# EAGLE design LedMatrix (EAGLE 7.4.0)
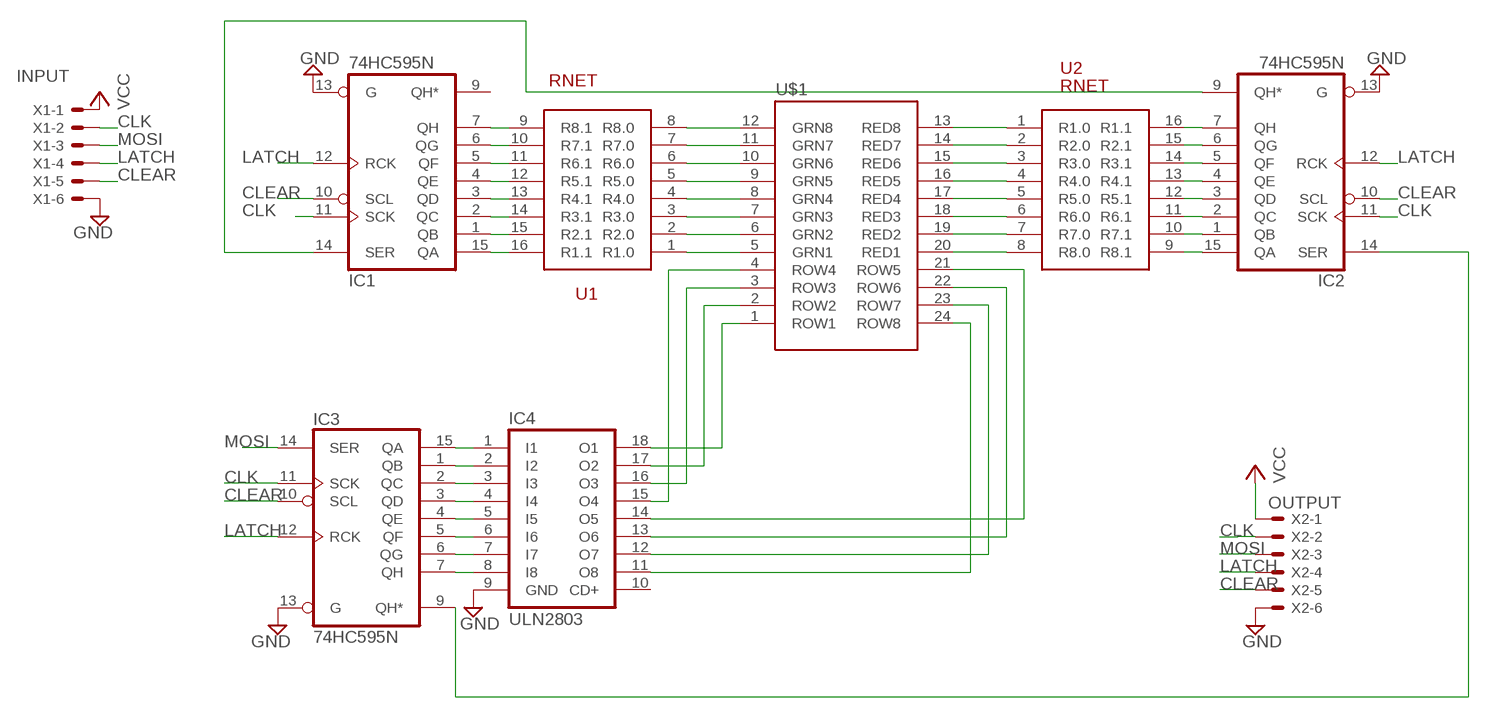
[diagram p0: schematic, sheet 1]

## Parts
IC1  74HC595N  [DIL16]
IC2  74HC595N  [DIL16]
IC3  74HC595N  [DIL16]
IC4  ULN2803  ULN2803A  [DIL18]
U1  RNET  RESISTER-NET-R4116  [DIP16]
U2  RNET  RESISTER-NET-R4116  [DIP16]
U$1  WLG-M2088A/8EG  [WLG-M2088A/8EG]
X1  INPUT  22-23-2061  [22-23-2061]
X2  OUTPUT  22-23-2061  [22-23-2061]

## Nets
CLEAR: IC1.10(SCL) IC2.10(SCL) IC3.10(SCL) X1.5 X2.5
CLK: IC1.11(SCK) IC2.11(SCK) IC3.11(SCK) X1.2 X2.2
GND: IC1.13(G) IC2.13(G) IC3.13(G) IC4.9(GND) X1.6 X2.6
LATCH: IC1.12(RCK) IC2.12(RCK) IC3.12(RCK) X1.4 X2.4
MOSI: IC3.14(SER) X1.3 X2.3
N$1: IC1.1(QB) U1.15(R2.1)
N$2: IC1.2(QC) U1.14(R3.1)
N$3: IC1.3(QD) U1.13(R4.1)
N$4: IC1.4(QE) U1.12(R5.1)
N$5: IC1.5(QF) U1.11(R6.1)
N$6: IC1.6(QG) U1.10(R7.1)
N$7: IC1.7(QH) U1.9(R8.1)
N$8: IC1.15(QA) U1.16(R1.1)
N$9: U1.1(R1.0) U$1.5(GRN1)
N$10: U1.2(R2.0) U$1.6(GRN2)
N$11: U1.3(R3.0) U$1.7(GRN3)
N$12: U1.4(R4.0) U$1.8(GRN4)
N$13: U1.5(R5.0) U$1.9(GRN5)
N$14: U1.6(R6.0) U$1.10(GRN6)
N$15: U1.7(R7.0) U$1.11(GRN7)
N$16: U1.8(R8.0) U$1.12(GRN8)
N$17: U2.1(R1.0) U$1.13(RED8)
N$18: U2.2(R2.0) U$1.14(RED7)
N$19: U2.3(R3.0) U$1.15(RED6)
N$20: U2.4(R4.0) U$1.16(RED5)
N$21: U2.5(R5.0) U$1.17(RED4)
N$22: U2.6(R6.0) U$1.18(RED3)
N$23: U2.7(R7.0) U$1.19(RED2)
N$24: U2.8(R8.0) U$1.20(RED1)
N$25: IC2.1(QB) U2.10(R7.1)
N$26: IC2.2(QC) U2.11(R6.1)
N$27: IC2.3(QD) U2.12(R5.1)
N$28: IC2.4(QE) U2.13(R4.1)
N$29: IC2.5(QF) U2.14(R3.1)
N$30: IC2.6(QG) U2.15(R2.1)
N$31: IC2.7(QH) U2.16(R1.1)
N$32: IC2.15(QA) U2.9(R8.1)
N$33: IC3.1(QB) IC4.2(I2)
N$34: IC3.2(QC) IC4.3(I3)
N$35: IC3.3(QD) IC4.4(I4)
N$36: IC3.4(QE) IC4.5(I5)
N$37: IC3.5(QF) IC4.6(I6)
N$38: IC3.6(QG) IC4.7(I7)
N$39: IC3.7(QH) IC4.8(I8)
N$40: IC3.15(QA) IC4.1(I1)
N$41: IC4.18(O1) U$1.1(ROW1)
N$42: IC4.17(O2) U$1.2(ROW2)
N$43: IC4.16(O3) U$1.3(ROW3)
N$44: IC4.15(O4) U$1.4(ROW4)
N$45: IC4.14(O5) U$1.21(ROW5)
N$46: IC4.13(O6) U$1.22(ROW6)
N$47: IC4.12(O7) U$1.23(ROW7)
N$48: IC4.11(O8) U$1.24(ROW8)
N$49: IC2.14(SER) IC3.9(QH*)
N$50: IC1.14(SER) IC2.9(QH*)
VCC: X1.1 X2.1
Unconnected: IC1.9(QH*) IC4.10(CD+)

## Power pins joined to a net without a drawn wire
GND: IC1.8(GND) IC2.8(GND) IC3.8(GND)
VCC: IC1.16(VCC) IC2.16(VCC) IC3.16(VCC)

## Library data of the parts
IC1-IC3 = 74xx-eu:74*595: 8-bit SHIFT REGISTER, output latch
IC4 = uln-udn:ULN2803A: DRIVER ARRAY
U1 U2 = sibosop:RESISTER-NET-R4116
U$1 = led-matrix-v2:WLG-M2088A: LED Matrix - Dual Color (Red + Green) - Medium sku: COM-00682 0.33 x 2 x 2"
X1 X2 = sibosop-con-molex:22-23-2061: .100" (2.54mm) Center Header - 6 Pin

## Board
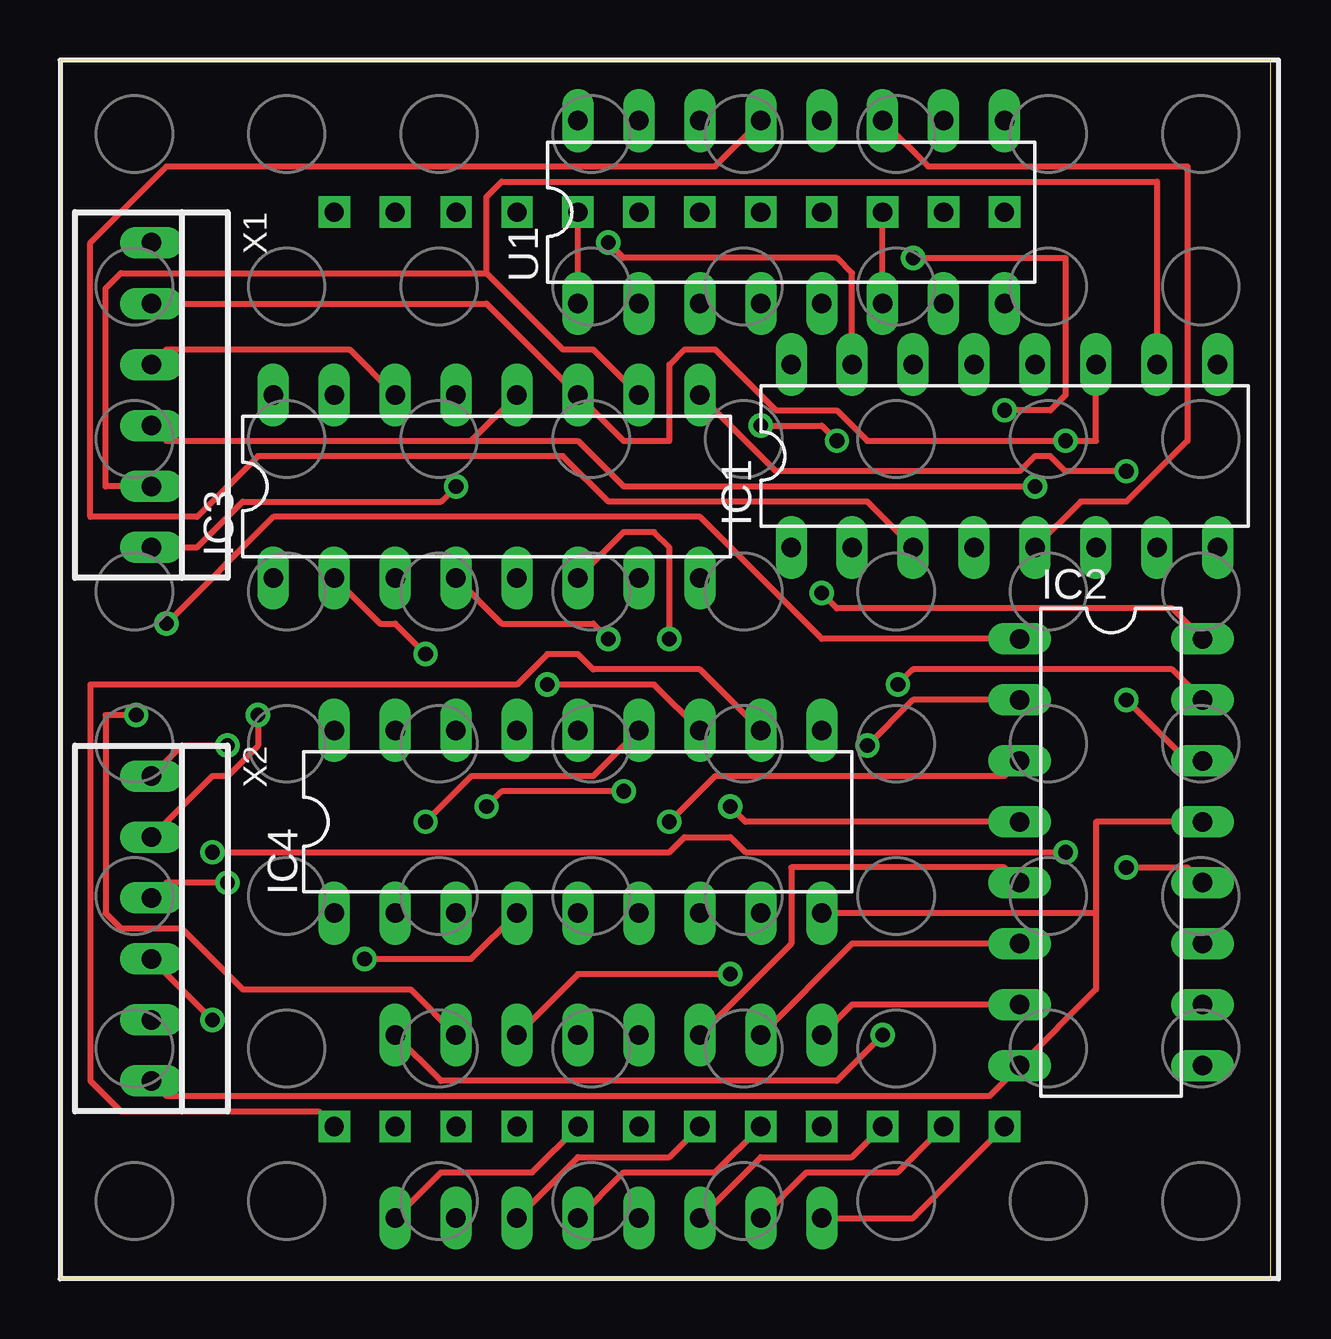
[diagram p1: board, top side]
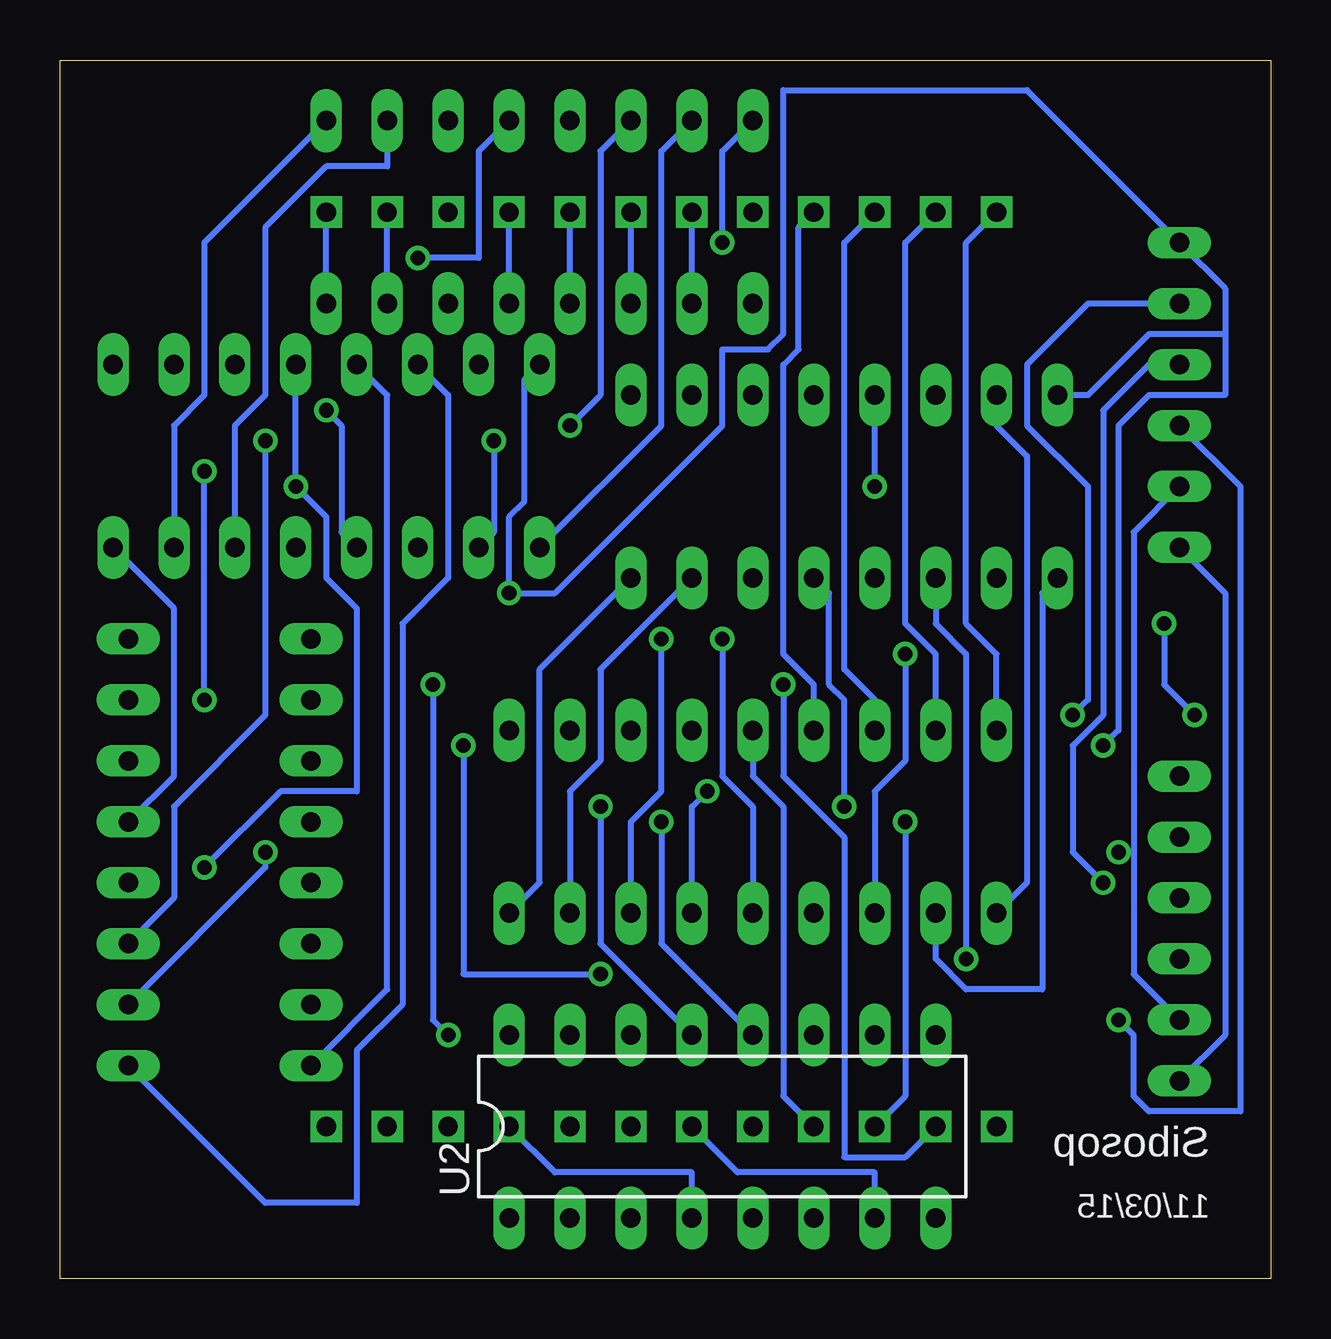
[diagram p2: board, bottom side, seen from below]

Size 50.47 x 50.79 mm. Coordinates in mm from the lower left corner, seen from the top.
Outline: 0,0 50.47,0 50.47,50.79 0,50.79 0,0
Copper layers (1*16): Top 0.035mm / dielectric 1.5mm / Bottom 0.035mm
Design rules "default": minimum track width 10mil, minimum drill 24mil, track to track 8mil, track to pad 8mil, pad to pad 8mil, via to via 8mil, smd to smd 8mil, copper to edge 40mil, drill to drill 8mil, minimum pad ring 10mil, minimum via ring 8mil, stop-mask expansion 4mil, vias tented up to drill 0mil, thermal gap 10mil

### Footprints (pad centres in the part's own frame; a part is rotated, then mirrored left to right if it is on the bottom)
DIL16 = drill 0.813 long: 1 -8.89,-3.81; 2 -6.35,-3.81; 3 -3.81,-3.81; 4 -1.27,-3.81; 5 1.27,-3.81; 6 3.81,-3.81; 7 6.35,-3.81; 8 8.89,-3.81; 9 8.89,3.81; 10 6.35,3.81; 11 3.81,3.81; 12 1.27,3.81; 13 -1.27,3.81; 14 -3.81,3.81; 15 -6.35,3.81; 16 -8.89,3.81
DIL18 = drill 0.813 long: 1 -10.16,-3.81; 2 -7.62,-3.81; 3 -5.08,-3.81; 4 -2.54,-3.81; 5 0,-3.81; 6 2.54,-3.81; 7 5.08,-3.81; 8 7.62,-3.81; 9 10.16,-3.81; 10 10.16,3.81; 11 7.62,3.81; 12 5.08,3.81; 13 2.54,3.81; 14 0,3.81; 15 -2.54,3.81; 16 -5.08,3.81; 17 -7.62,3.81; 18 -10.16,3.81
DIP16 = drill 0.813 long: 1 -8.89,-3.81; 2 -6.35,-3.81; 3 -3.81,-3.81; 4 -1.27,-3.81; 5 1.27,-3.81; 6 3.81,-3.81; 7 6.35,-3.81; 8 8.89,-3.81; 9 8.89,3.81; 10 6.35,3.81; 11 3.81,3.81; 12 1.27,3.81; 13 -1.27,3.81; 14 -3.81,3.81; 15 -6.35,3.81; 16 -8.89,3.81
WLG-M2088A/8EG = drill 0.8 square: 1 -13.97,19.05; 2 -11.43,19.05; 3 -8.89,19.05; 4 -6.35,19.05; 5 -3.81,19.05; 6 -1.27,19.05; 7 1.27,19.05; 8 3.81,19.05; 9 6.35,19.05; 10 8.89,19.05; 11 11.43,19.05; 12 13.97,19.05; 13 13.97,-19.05; 14 11.43,-19.05; 15 8.89,-19.05; 16 6.35,-19.05; 17 3.81,-19.05; 18 1.27,-19.05; 19 -1.27,-19.05; 20 -3.81,-19.05; 21 -6.35,-19.05; 22 -8.89,-19.05; 23 -11.43,-19.05; 24 -13.97,-19.05
22-23-2061 = drill 0.813 long: 1 -6.35,0; 2 -3.81,0; 3 -1.27,0; 4 1.27,0; 5 3.81,0; 6 6.35,0

### Placement (x,y rotation side)
IC1  39.37,34.29 0 top
IC2  43.81,17.78 270 top
IC3  17.78,33.02 0 top
IC4  21.59,19.05 0 top
U1  30.48,44.45 0 top
U2  22.86,6.35 0 bottom
U$1  25.4,25.4 0 top
X1  3.81,36.83 270 top
X2  3.81,14.61 270 top

### Tracks (layer width: path | path; a pad name or v marks a point on that pad's centre or on a via)
CLEAR  (via drill 0.61)
  Top 0.254: v41.91,17.78 28.57,17.78 27.94,18.41 26.04,18.41 25.4,17.78 v6.35,17.78 | IC3.10 22.23,38.73 20.95,38.73 17.78,41.91 | 17.78,41.91 2.54,41.91 1.91,41.27 1.91,33.02 X1.5 | IC1.10 45.72,45.72 18.41,45.72 17.78,45.09 17.78,41.91
  Bottom 0.254: X2.5 5.71,12.7 5.71,17.78 | 5.71,17.78 5.71,31.11 X1.5 | IC2.10 41.91,17.14 v41.91,17.78 | 5.71,17.78 v6.35,17.78
CLK  (via drill 0.61)
  Top 0.254: X2.2 6.35,20.95 6.99,20.95 8.26,22.23 v8.26,23.5 | X1.2 17.78,40.64 IC3.11 23.5,34.92 25.4,34.92 25.4,38.1 26.04,38.73 27.3,38.73 29.84,36.2 32.38,36.2 33.66,34.92 v41.91,34.92 43.18,34.92 IC1.11
  Bottom 0.254: v8.26,23.5 7.62,24.13 7.62,33.02 10.16,35.56 10.16,38.1 7.62,40.64 X1.2 | IC2.11 45.72,15.88 45.72,19.68 41.91,23.5 v41.91,34.92
GND  (via drill 0.61)
  Top 0.254: v16.51,33.02 15.88,32.38 7.62,32.38 5.71,30.48 X1.6 | 43.18,15.24 43.18,19.05 IC2.13 | 43.18,15.24 43.18,12.06 IC2.8 38.73,7.62 4.45,7.62 X2.6 | 43.18,15.24 IC4.9
  Bottom 0.254: X2.6 1.91,10.16 1.91,28.57 X1.6 | v16.51,33.02 IC3.13 | IC3.8 30.48,25.4 30.48,16.51 IC4.9 | IC1.13 36.83,36.83 36.83,12.06 IC2.8 | IC1.8 45.72,27.94 45.72,20.95 IC2.13
LATCH  (via drill 0.61)
  Top 0.254: v6.35,10.79 X2.4 | 17.14,34.92 IC3.12 | 17.14,34.92 4.45,34.92 X1.4 | v40.64,33.02 23.5,33.02 21.59,34.92 17.14,34.92 | IC2.12 46.99,17.14 v44.45,17.14
  Bottom 0.254: v6.35,10.79 5.71,10.16 5.71,7.62 5.08,6.99 1.27,6.99 1.27,33.02 X1.4 | IC1.12 v40.64,33.02 39.37,31.75 39.37,29.21 38.1,27.94 38.1,20.32 41.27,20.32 v44.45,17.14
MOSI  (via drill 0.61)
  Top 0.254: X2.3 4.45,16.51 v6.99,16.51 | IC3.14 12.06,38.73 4.45,38.73 X1.3
  Bottom 0.254: v6.99,16.51 8.26,17.78 8.26,22.23 6.99,23.5 6.99,36.2 5.08,38.1 X1.3
N$1
  Bottom 0.254: U1.15 25.4,46.99 25.4,35.56 IC1.1
N$2  (via drill 0.61)
  Top 0.254: v32.38,34.92 31.75,35.56 v29.21,35.56
  Bottom 0.254: IC1.2 32.38,31.11 v32.38,34.92 | v29.21,35.56 27.94,36.83 27.94,46.99 U1.14
N$3
  Top 0.254: U1.13 27.3,46.35 4.45,46.35 1.27,43.18 1.27,31.75 5.71,31.75 8.26,34.29 20.95,34.29 22.86,32.38 33.66,32.38 IC1.3
N$4  (via drill 0.61)
  Top 0.254: v39.37,36.2 41.27,36.2 41.91,36.83 41.91,42.55 v35.56,42.55
  Bottom 0.254: IC1.4 38.73,31.11 38.73,35.56 v39.37,36.2 | v35.56,42.55 33.02,42.55 33.02,46.99 U1.12
N$5
  Top 0.254: IC1.5 42.55,32.38 44.45,32.38 46.99,34.92 46.99,46.35 36.2,46.35 U1.11
N$6
  Bottom 0.254: IC1.6 43.18,35.56 41.91,36.83 41.91,43.81 39.37,46.35 36.83,46.35 U1.10
N$7
  Bottom 0.254: IC1.7 45.72,35.56 44.45,36.83 44.45,43.18 U1.9
N$8  (via drill 0.61)
  Top 0.254: v22.86,43.18 23.5,42.55 32.38,42.55 33.02,41.91 IC1.15
  Bottom 0.254: U1.16 22.86,46.99 v22.86,43.18
N$9
  Top 0.254: U1.1 U$1.5
N$10
  Bottom 0.254: U1.2 U$1.6
N$11
  Bottom 0.254: U1.3 U$1.7
N$12
  Bottom 0.254: U1.4 U$1.8
N$13
  Bottom 0.254: U1.5 U$1.9
N$14
  Top 0.254: U1.6 U$1.10
N$15
  Bottom 0.254: U1.7 U$1.11
N$16
  Bottom 0.254: U1.8 U$1.12
N$17
  Top 0.254: U$1.13 35.56,2.54 U2.1
N$18
  Top 0.254: U$1.14 34.92,4.45 31.11,4.45 U2.2
N$19
  Top 0.254: U$1.15 33.02,5.08 29.21,5.08 U2.3
N$20
  Bottom 0.254: U$1.16 29.84,4.45 24.13,4.45 U2.4
N$21
  Top 0.254: U$1.17 27.3,4.45 23.5,4.45 U2.5
N$22
  Top 0.254: U$1.18 25.4,5.08 21.59,5.08 U2.6
N$23
  Bottom 0.254: U$1.19 22.23,4.45 16.51,4.45 U2.7
N$24
  Top 0.254: U$1.20 19.68,4.45 15.88,4.45 U2.8
N$25  (via drill 0.61)
  Top 0.254: U2.10 14.61,12.06 7.62,12.06 5.08,14.61 2.54,14.61 1.91,15.24 1.91,23.5 v3.17,23.5 | v4.45,27.3 8.89,31.75 26.67,31.75 31.75,26.67 IC2.1
  Bottom 0.254: v3.17,23.5 4.45,24.77 v4.45,27.3
N$26  (via drill 0.61)
  Top 0.254: U2.11 21.59,12.7 v27.94,12.7 | v33.66,22.23 35.56,24.13 IC2.2
  Bottom 0.254: v27.94,12.7 33.66,12.7 v33.66,22.23
N$27  (via drill 0.61)
  Top 0.254: v25.4,19.05 27.3,20.95 39.37,20.95 IC2.3
  Bottom 0.254: U2.12 25.4,13.97 v25.4,19.05
N$28  (via drill 0.61)
  Top 0.254: v27.94,19.68 28.57,19.05 IC2.4
  Bottom 0.254: U2.13 27.94,13.97 v27.94,19.68
N$29
  Top 0.254: U2.14 30.48,13.97 30.48,17.14 39.37,17.14 IC2.5
N$30
  Top 0.254: U2.15 33.02,13.97 IC2.6
N$31
  Top 0.254: U2.16 33.02,11.43 IC2.7
N$32  (via drill 0.61)
  Top 0.254: U2.9 15.88,8.26 32.38,8.26 v34.29,10.16 | v34.92,24.77 35.56,25.4 46.35,25.4 IC2.15
  Bottom 0.254: v34.29,10.16 34.92,10.79 v34.92,24.77
N$33
  Bottom 0.254: IC4.2 13.97,13.34 12.7,12.06 9.53,12.06 9.53,28.57 IC3.1
N$34  (via drill 0.61)
  Top 0.254: v15.24,26.04 13.97,27.3 13.34,27.3 IC3.2
  Bottom 0.254: IC4.3 16.51,20.32 15.24,21.59 v15.24,26.04
N$35  (via drill 0.61)
  Top 0.254: IC4.4 17.14,13.34 v12.7,13.34
  Bottom 0.254: v12.7,13.34 12.7,26.04 13.97,27.3 IC3.3
N$36  (via drill 0.61)
  Top 0.254: v22.86,26.67 22.23,27.3 18.41,27.3 IC3.4
  Bottom 0.254: IC4.5 21.59,19.68 22.86,20.95 v22.86,26.67
N$37  (via drill 0.61)
  Top 0.254: v17.78,19.68 18.41,20.32 v23.5,20.32
  Bottom 0.254: IC3.5 18.41,28.57 18.41,24.77 17.78,24.13 v17.78,19.68 | v23.5,20.32 24.13,19.68 IC4.6
N$38  (via drill 0.61)
  Top 0.254: IC3.6 23.5,31.11 24.77,31.11 25.4,30.48 v25.4,26.67
  Bottom 0.254: v25.4,26.67 25.4,20.32 26.67,19.05 IC4.7
N$39
  Bottom 0.254: IC4.8 29.21,20.32 27.94,21.59 27.94,25.4 IC3.7
N$40
  Bottom 0.254: IC4.1 10.16,16.51 10.16,34.29 11.43,35.56 IC3.15
N$41
  Bottom 0.254: U$1.1 12.7,43.18 12.7,27.3 11.43,26.04 IC4.18
N$42
  Bottom 0.254: U$1.2 15.24,43.18 15.24,27.3 13.97,26.04 IC4.17
N$43
  Bottom 0.254: U$1.3 17.78,43.18 17.78,25.4 16.51,24.13 IC4.16
N$44
  Bottom 0.254: U$1.4 19.68,43.81 19.68,38.73 20.32,38.1 20.32,26.04 19.05,24.77 IC4.15
N$45
  Bottom 0.254: U$1.21 20.32,7.62 20.32,19.68 21.59,20.95 IC4.14
N$46  (via drill 0.61)
  Top 0.254: v15.24,19.05 17.14,20.95 22.23,20.95 IC4.13
  Bottom 0.254: U$1.22 15.24,7.62 v15.24,19.05
N$47  (via drill 0.61)
  Top 0.254: v20.32,24.77 24.77,24.77 IC4.12
  Bottom 0.254: U$1.23 15.24,5.08 17.78,5.08 17.78,18.41 20.32,20.95 v20.32,24.77
N$48
  Top 0.254: U$1.24 10.79,6.99 2.54,6.99 1.27,8.26 1.27,24.77 19.05,24.77 20.32,26.04 21.59,26.04 22.23,25.4 26.67,25.4 IC4.11
N$49  (via drill 0.61)
  Top 0.254: IC3.9 29.84,33.66 40.01,33.66 40.64,34.29 41.27,34.29 41.91,33.66 v44.45,33.66 | v44.45,24.13 46.99,21.59 IC2.14
  Bottom 0.254: v44.45,24.13 v44.45,33.66
N$50
  Bottom 0.254: IC2.9 41.91,3.17 38.1,3.17 38.1,9.53 36.2,11.43 36.2,27.3 34.29,29.21 34.29,36.83 IC1.14
VCC  (via drill 0.61)
  Top 0.254: X2.1 5.08,22.23 v6.99,22.23 | v31.75,28.57 32.38,27.94 46.35,27.94 IC2.16
  Bottom 0.254: v6.99,22.23 6.35,22.86 6.35,35.56 5.08,36.83 1.91,36.83 1.91,39.37 | 1.91,39.37 1.91,41.27 X1.1 10.16,49.53 20.32,49.53 20.32,39.37 20.95,38.73 22.86,38.73 22.86,35.56 29.84,28.57 v31.75,28.57 31.75,31.75 31.11,32.38 31.11,37.47 IC1.16 | IC3.16 7.62,36.83 5.08,39.37 1.91,39.37

### Text on the board
bNames: Sibosop | 11/03/15